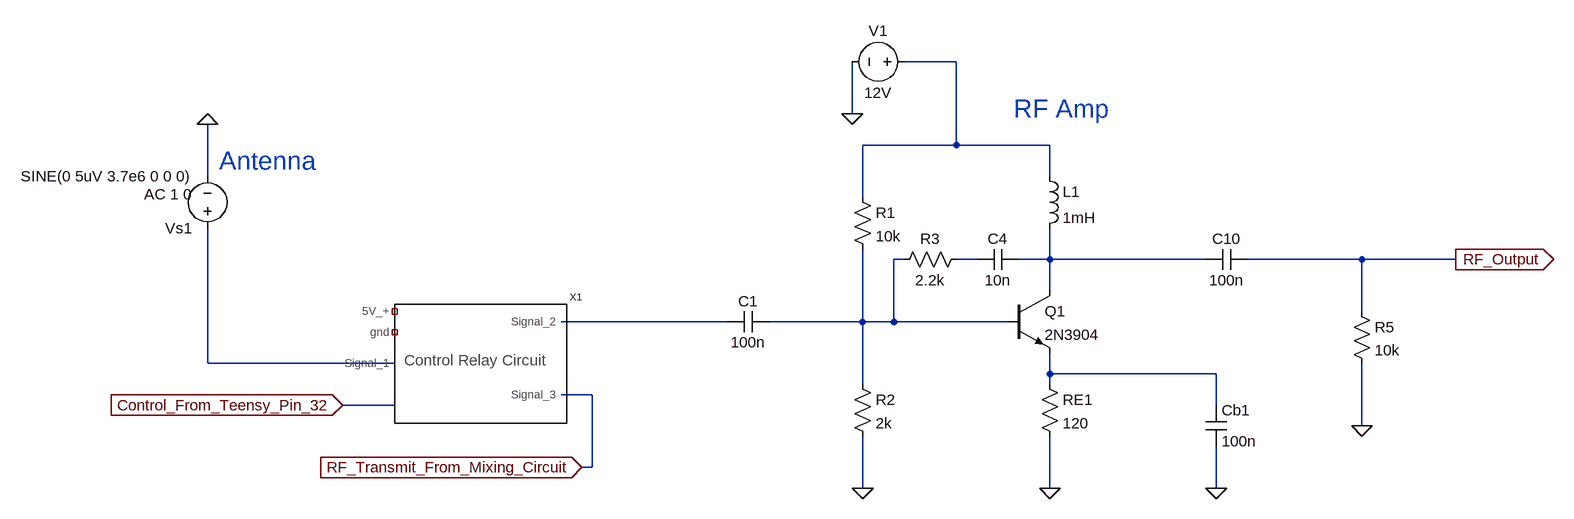
[diagram p0: schematic Antenna & Amp.asc]
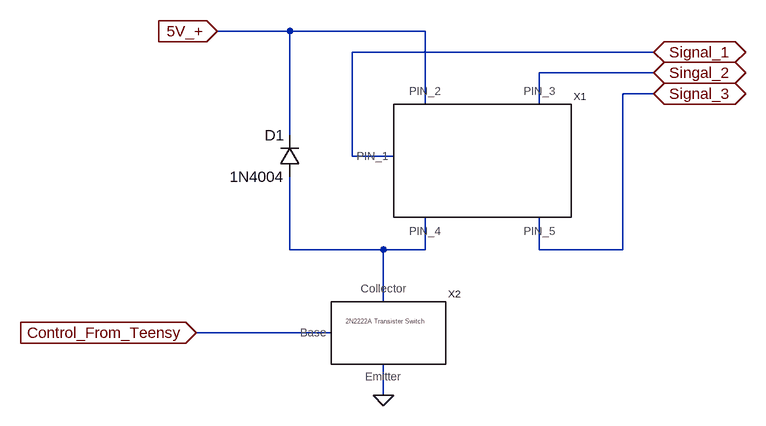
[diagram p1: sub-circuit relay_with_control.asc]
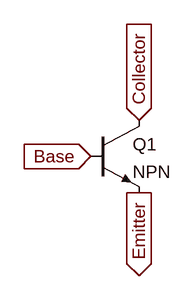
[diagram p2: sub-circuit transistor_switch_(poweramp_for_teensy_to_relay).asc]
Antenna & Amp.asc, the LTspice schematic file:
Version 4
SHEET 1 1400 712
WIRE -320 -32 -400 -32
WIRE -480 48 -480 -32
WIRE -320 96 -320 -32
WIRE -320 96 -464 96
WIRE -176 96 -320 96
WIRE -1472 144 -1472 64
WIRE -176 144 -176 96
WIRE -464 176 -464 96
WIRE -400 272 -416 272
WIRE -288 272 -320 272
WIRE -176 272 -176 224
WIRE -176 272 -224 272
WIRE 64 272 -176 272
WIRE 304 272 128 272
WIRE 448 272 304 272
WIRE -176 320 -176 272
WIRE 304 352 304 272
WIRE -672 368 -928 368
WIRE -464 368 -464 256
WIRE -464 368 -608 368
WIRE -416 368 -416 272
WIRE -416 368 -464 368
WIRE -240 368 -416 368
WIRE -1472 432 -1472 224
WIRE -1184 432 -1472 432
WIRE -176 448 -176 416
WIRE 80 448 -176 448
WIRE -464 464 -464 368
WIRE -176 464 -176 448
WIRE -880 480 -928 480
WIRE -1184 496 -1264 496
WIRE 80 496 80 448
WIRE 304 528 304 432
WIRE -880 592 -880 480
WIRE -880 592 -896 592
WIRE -464 624 -464 544
WIRE -176 624 -176 544
WIRE 80 624 80 560
FLAG -480 48 0
FLAG -1472 64 0
FLAG -464 624 0
FLAG -176 624 0
FLAG 80 624 0
FLAG 304 528 0
FLAG 448 272 RF_Output
IOPIN 448 272 Out
FLAG -896 592 RF_Transmit_From_Mixing_Circuit
IOPIN -896 592 In
FLAG -1264 496 Control_From_Teensy_Pin_32
IOPIN -1264 496 In
SYMBOL voltage -384 -32 R90
WINDOW 0 -32 56 VBottom 2
WINDOW 3 32 56 VTop 2
WINDOW 123 0 0 Left 2
WINDOW 39 0 0 Left 2
SYMATTR InstName V1
SYMATTR Value 12V
SYMBOL res -480 160 R0
SYMATTR InstName R1
SYMATTR Value 10k
SYMBOL res -480 448 R0
SYMATTR InstName R2
SYMATTR Value 2k
SYMBOL res -192 448 R0
SYMATTR InstName RE1
SYMATTR Value 120
SYMBOL npn -240 320 R0
SYMATTR InstName Q1
SYMATTR Value 2N3904
SYMBOL voltage -1472 240 R180
WINDOW 123 24 68 Left 2
WINDOW 39 0 0 Left 2
SYMATTR Value2 AC 1 0
SYMATTR InstName Vs1
SYMATTR Value SINE(0 5uV 3.7e6 0 0 0)
SYMBOL cap -608 352 R90
WINDOW 0 0 32 VBottom 2
WINDOW 3 32 32 VTop 2
SYMATTR InstName C1
SYMATTR Value 100n
SYMBOL cap 64 496 R0
SYMATTR InstName Cb1
SYMATTR Value 100n
SYMBOL cap -224 256 R90
WINDOW 0 0 32 VBottom 2
WINDOW 3 32 32 VTop 2
SYMATTR InstName C4
SYMATTR Value 10n
SYMBOL res -304 256 R90
WINDOW 0 0 56 VBottom 2
WINDOW 3 32 56 VTop 2
SYMATTR InstName R3
SYMATTR Value 2.2k
SYMBOL ind -192 128 R0
SYMATTR InstName L1
SYMATTR Value 1mH
SYMBOL cap 128 256 R90
WINDOW 0 0 32 VBottom 2
WINDOW 3 32 32 VTop 2
SYMATTR InstName C10
SYMATTR Value 100n
SYMBOL res 288 336 R0
SYMATTR InstName R5
SYMATTR Value 10k
SYMBOL Final\ SDR\ schematics\ for\ SDD\ 4_28_19\\Relay_With_Control -1040 432 R0
SYMATTR InstName X1
TEXT -1304 120 Right 4 ;Antenna
TEXT -232 40 Left 4 ;RF Amp

relay_with_control.asc, the sub-circuit schematic file:
Version 4
SHEET 1 880 680
WIRE -64 -16 -176 -16
WIRE 144 -16 -64 -16
WIRE 496 16 32 16
WIRE 496 48 320 48
WIRE 496 80 448 80
WIRE 144 96 144 -16
WIRE 320 96 320 48
WIRE -64 144 -64 -16
WIRE 32 176 32 16
WIRE 96 176 32 176
WIRE -64 320 -64 208
WIRE 80 320 -64 320
WIRE 144 320 144 272
WIRE 144 320 80 320
WIRE 320 320 320 272
WIRE 448 320 448 80
WIRE 448 320 320 320
WIRE 80 400 80 320
WIRE 0 448 -208 448
WIRE 80 544 80 496
FLAG -176 -16 5V_+
IOPIN -176 -16 In
FLAG -208 448 Control_From_Teensy
IOPIN -208 448 In
FLAG 496 16 Signal_1
IOPIN 496 16 BiDir
FLAG 496 48 Singal_2
IOPIN 496 48 BiDir
FLAG 496 80 Signal_3
IOPIN 496 80 BiDir
FLAG 80 544 0
SYMBOL Relay 272 224 R0
SYMATTR InstName X1
SYMBOL Transistor_switch_(powerAMP_for_Teensy_to_relay) 64 448 R0
SYMATTR InstName X2
SYMBOL diode -48 208 R180
WINDOW 0 24 64 Left 2
WINDOW 3 24 0 Left 2
SYMATTR InstName D1
SYMATTR Value 1N4004

transistor_switch_(poweramp_for_teensy_to_relay).asc, the sub-circuit schematic file:
Version 4
SHEET 1 880 680
FLAG 128 144 Base
IOPIN 128 144 In
FLAG 192 192 Emitter
IOPIN 192 192 Out
FLAG 192 96 Collector
IOPIN 192 96 In
SYMBOL npn 128 96 R0
SYMATTR InstName Q1

The netlist it stands for:
* Antenna & Amp.asc
V1 N001 0 12V
R1 N001 N002 10k
R2 N002 0 2k
RE1 N007 0 120
Q1 N004 N002 N007 0 2N3904
Vs1 N006 0 SINE(0 5uV 3.7e6 0 0 0) AC 1 0
C1 N002 N005 100n
Cb1 N007 0 100n
C4 N004 N003 10n
R3 N003 N002 2.2k
L1 N001 N004 1mH
C10 RF_Output N004 100n
R5 RF_Output 0 10k
XX1 NC_01 NC_02 Control_From_Teensy_Pin_32 N006 N005 RF_Transmit_From_Mixing_Circuit relay_with_control

* block symbol definitions
.subckt relay_with_control 5V_+ gnd  Signal_1 Signal_2 Signal_3
XX1 Signal_1 5V_+ Singal_2 N001 Signal_3 Relay  ; pins PIN_1 PIN_2 PIN_3 PIN_4 PIN_5
XX2 Control_From_Teensy N001 0 transistor_switch_(poweramp_for_teensy_to_relay)
D1 N001 5V_+ 1N4004
.ends relay_with_control

.subckt transistor_switch_(poweramp_for_teensy_to_relay) Base Collector Emitter
Q1 Collector Base Emitter 0 NPN
.ends transistor_switch_(poweramp_for_teensy_to_relay)

.model D D
.lib standard.dio
.model NPN NPN
.model PNP PNP
.lib standard.bjt
* Antenna
* RF Amp
.backanno
.end